# EAGLE design RC_Car_new (EAGLE 9.6.2)
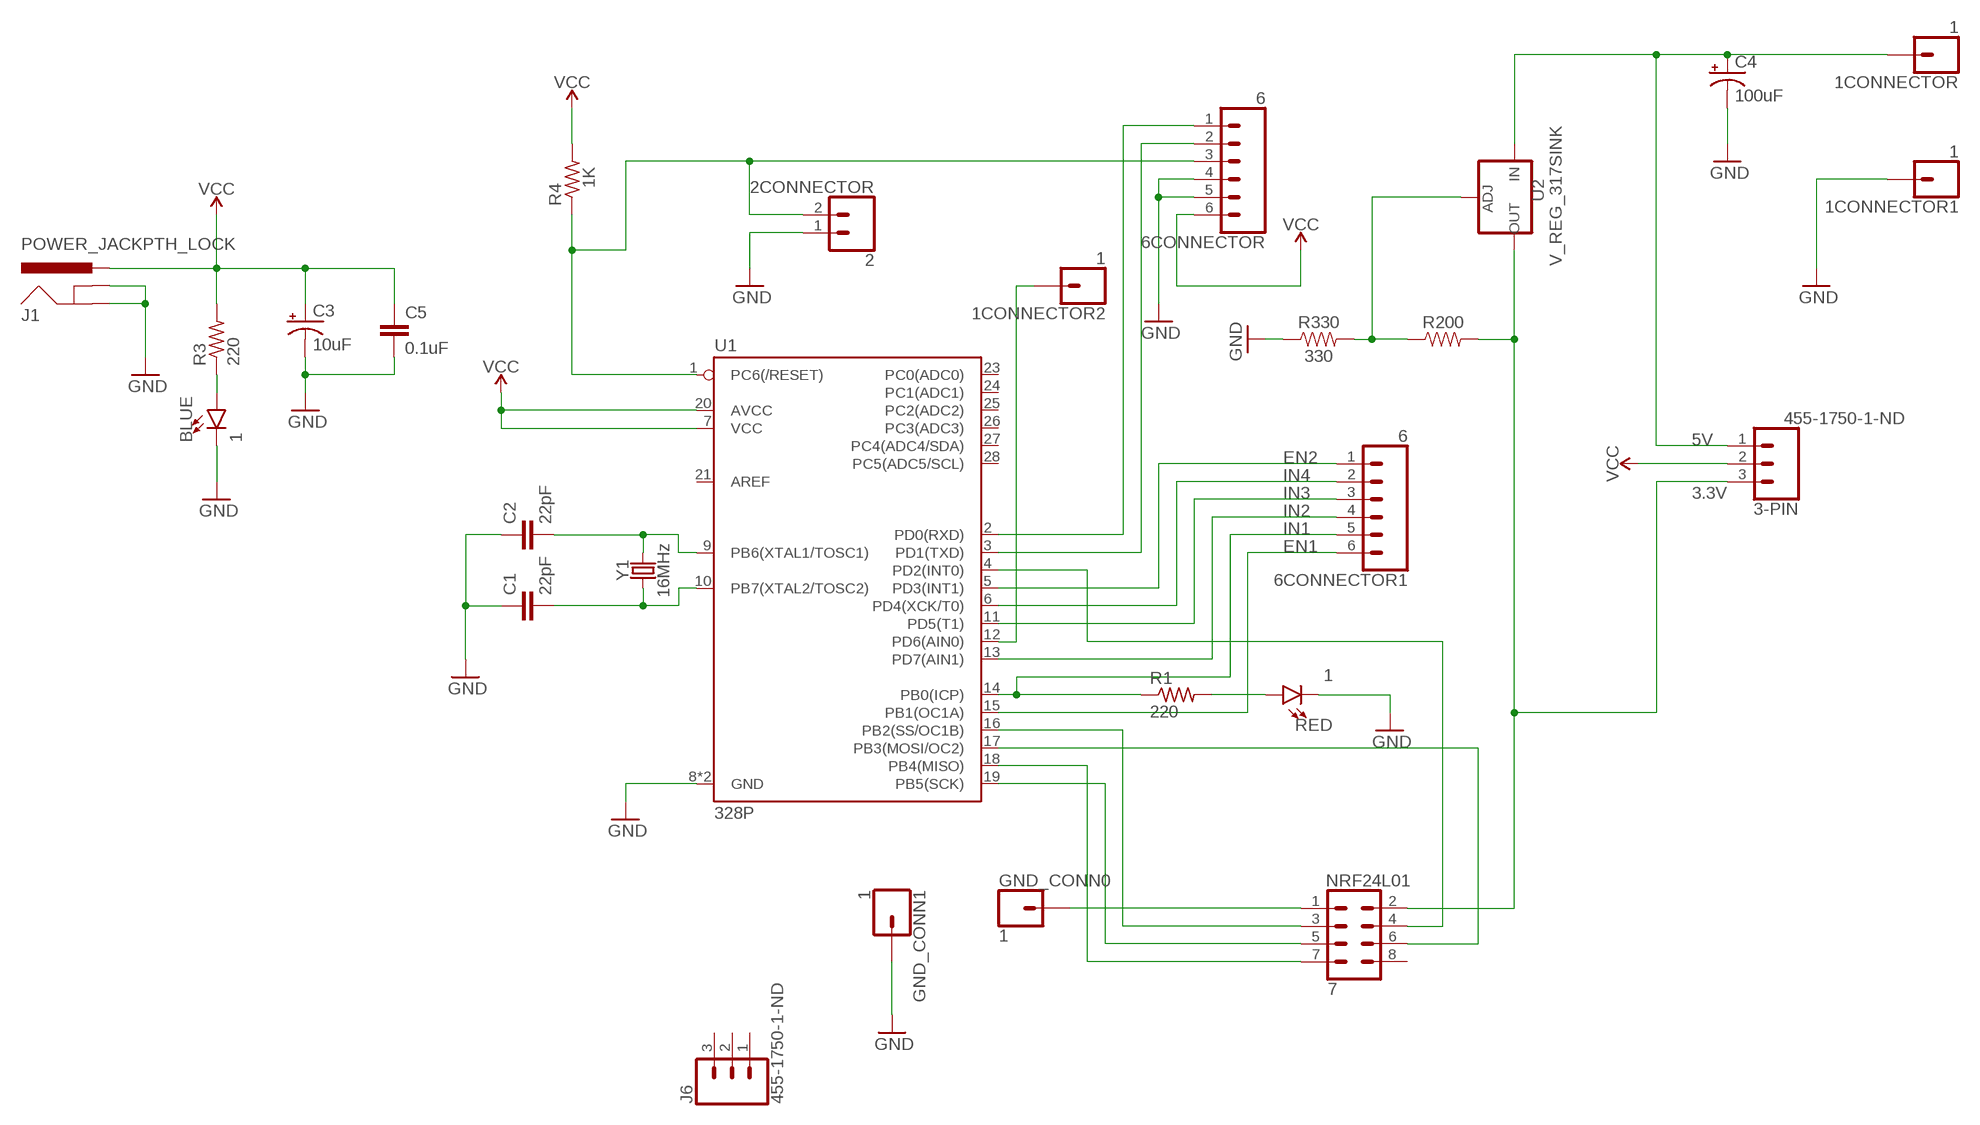
[diagram p0: schematic, sheet 1]

## Parts
1CONNECTOR  1  CONN_01  [1X01]
1CONNECTOR1  1  CONN_01  [1X01]
1CONNECTOR2  1  CONN_01  [1X01]
2CONNECTOR  2  CONN_02  [1X02]
3-PIN  455-1750-1-ND  CONN_03  [1X03]
6CONNECTOR  6  CONN_06SILK_FEMALE_PTH  [1X06]
6CONNECTOR1  6  CONN_06SILK_FEMALE_PTH  [1X06]
BLUE  1  LED3MM  [LED_3MM]
C1  22pF  22PF-PTH-2.54MM-200V-5%  [CAP-PTH-2.54]
C2  22pF  22PF-PTH-2.54MM-200V-5%  [CAP-PTH-2.54]
C3  10uF  10UF-POLAR-RADIAL-2.5MM-25V-20%  [CPOL-RADIAL-2.5MM-5MM]
C4  100uF  100UF-POLAR-RADIAL-2.5MM-25V-20%  [CPOL-RADIAL-2.5MM-6.5MM]
C5  0.1uF  0.1UF-KIT-EZ-50V-20%  [CAP-PTH-SMALL-KIT]
GND_CONN0  1  CONN_01  [1X01]
GND_CONN1  1  CONN_01  [1X01]
J1  POWER_JACKPTH_LOCK  [POWER_JACK_PTH_LOCK]
J6  455-1750-1-ND  CONN_03  [1X03]
NRF24L01  7  CONN_04X2  [2X4]
R1  220  R-US_0207/10  [0207/10]
R3  220  R-US_0207/10  [0207/10]
R4  1K  R-US_0207/10  [0207/10]
R200  RESISTORAXIAL-0.3  [AXIAL-0.3]
R330  330  330OHM-HORIZ-1/10W-5%  [AXIAL-0.3]
RED  1  LED3MM  [LED_3MM]
U1  328P  ATMEGA328P_PDIP  [DIP28]
U2  V_REG_317SINK  [TO220-ADJ]
Y1  16MHz  CRYSTAL-16MHZPTH-HC49US  [HC49US]

## Nets
3.3V: 3-PIN.3 NRF24L01.2 R200.P$2 U2.OUT
5V: 1CONNECTOR.1 3-PIN.1 C4.1(+) U2.IN
EN1: 6CONNECTOR1.6 U1.15(PB1(OC1A))
EN2: 6CONNECTOR1.1 U1.5(PD3(INT1))
GND: 1CONNECTOR1.1 2CONNECTOR.1 6CONNECTOR.4 6CONNECTOR.5 BLUE.K(C) C1.1 C2.1 C3.2(-) C4.2(-) C5.2 GND_CONN1.1 J1.GND J1.GNDBREAK R330.P$1 RED.K(C) U1.8(GND) U1.22(GND)
IN1: 6CONNECTOR1.5 R1.1 U1.14(PB0(ICP))
IN2: 6CONNECTOR1.4 U1.13(PD7(AIN1))
IN3: 6CONNECTOR1.3 U1.11(PD5(T1))
IN4: 6CONNECTOR1.2 U1.6(PD4(XCK/T0))
N$1: 2CONNECTOR.2 6CONNECTOR.3 R4.1 U1.1(PC6(/RESET))
N$2: BLUE.A R3.1
N$3: C2.2 U1.9(PB6(XTAL1/TOSC1)) Y1.2
N$4: C1.2 U1.10(PB7(XTAL2/TOSC2)) Y1.1
N$5: 1CONNECTOR2.1 U1.12(PD6(AIN0))
N$6: R1.2 RED.A
N$7: GND_CONN0.1 NRF24L01.1
N$8: NRF24L01.3 U1.16(PB2(SS/OC1B))
N$9: 6CONNECTOR.1 U1.2(PD0(RXD))
N$10: 6CONNECTOR.2 U1.3(PD1(TXD))
N$11: R200.P$1 R330.P$2 U2.ADJ
N$12: NRF24L01.4 U1.4(PD2(INT0))
N$13: NRF24L01.6 U1.17(PB3(MOSI/OC2))
N$14: NRF24L01.5 U1.19(PB5(SCK))
N$15: NRF24L01.7 U1.18(PB4(MISO))
VCC: 3-PIN.2 6CONNECTOR.6 C3.1(+) C5.1 J1.PWR R3.2 R4.2 U1.7(VCC) U1.20(AVCC)
Unconnected: J6.1 J6.2 J6.3 NRF24L01.8 U1.21(AREF) U1.23(PC0(ADC0)) U1.24(PC1(ADC1)) U1.25(PC2(ADC2)) U1.26(PC3(ADC3)) U1.27(PC4(ADC4/SDA)) U1.28(PC5(ADC5/SCL))

## Library data of the parts
1CONNECTOR 1CONNECTOR1 1CONNECTOR2 GND_CONN0 GND_CONN1 = SparkFun-Connectors:CONN_01: Single connection point. Often used as Generic Header-pin footprint for 0.1 inch spaced/style header connections On any of the 0.1 inch spaced packages, you can populate with these: Break Away Headers - Straight <https://www.sparkfun.com/products/116> (PRT-00116) Break Away Male Headers - Right Angle <https://www.sparkfun.com/products/553> (PRT-00553) Female Headers <https://www.sparkfun.com/products/115> (PRT-00115) Break Away Headers - Machine Pin <https://www.sparkfun.com/products/117> (PRT-00117) Break Away Female Headers - Swiss Machine Pin <https://www.sparkfun.com/products/743> (PRT-00743) This device is also useful as a general connection point to wire up your design to another part of your project. Our various solder wires solder well into these plated through hole pads. Hook-Up Wire - Assortment (Stranded, 22 AWG) <https://www.sparkfun.com/products/11375> (PRT-11375) Hook-Up Wire - Assortment (Solid Core, 22 AWG) <https://www.sparkfun.com/products/11367> (PRT-11367) View the entire wire category on our website here <https://www.sparkfun.com/categories/141> Special notes: SMTSO-256-ET is a "flush mount" nut for a 4-40 screw. We mostly use this on specialty testbeds; it is a nice way to connect hardware to your PCB at an adjustable hieght. Also note, the SNAP packages are for using a snappable style connector. We sell a baggie of snaps and they are also used on two LilyPad designs: Snap Assortment - 30 pack (male and female) <https://www.sparkfun.com/products/11347> (DEV-11347) LilyPad Arduino SimpleSnap <https://www.sparkfun.com/products/10941> (DEV-10941) LilyPad SimpleSnap Protoboard <https://www.sparkfun.com/products/10940> (DEV-10940)
2CONNECTOR = SparkFun-Connectors:CONN_02: Multi connection point. Often used as Generic Header-pin footprint for 0.1 inch spaced/style header connections On any of the 0.1 inch spaced packages, you can populate with these: Break Away Headers - Straight <https://www.sparkfun.com/products/116> (PRT-00116) Break Away Male Headers - Right Angle <https://www.sparkfun.com/products/553> (PRT-00553) Female Headers <https://www.sparkfun.com/products/115> (PRT-00115) Break Away Headers - Machine Pin <https://www.sparkfun.com/products/117> (PRT-00117) Break Away Female Headers - Swiss Machine Pin <https://www.sparkfun.com/products/743> (PRT-00743) For SCREWTERMINALS and SPRING TERMINALS visit here: Screw Terimnals on SparkFun.com <https://www.sparkfun.com/search/results?term=Screw+Terminals> (5mm/3.5mm/2.54mm spacing) This device is also useful as a general connection point to wire up your design to another part of your project. Our various solder wires solder well into these plated through hole pads. Hook-Up Wire - Assortment (Stranded, 22 AWG) <https://www.sparkfun.com/products/11375> (PRT-11375) Hook-Up Wire - Assortment (Solid Core, 22 AWG) <https://www.sparkfun.com/products/11367> (PRT-11367) View the entire wire category on our website here <https://www.sparkfun.com/categories/141> Special notes: Molex polarized connector foot print use with: PRT-08233 with associated crimp pins and housings. 2.54_SCREWTERM for use with PRT-10571. 3.5mm Screw Terminal footprints for PRT-08084 5mm Screw Terminal footprints for use with PRT-08432
3-PIN J6 = SparkFun-Connectors:CONN_03: Multi connection point. Often used as Generic Header-pin footprint for 0.1 inch spaced/style header connections On any of the 0.1 inch spaced packages, you can populate with these: Break Away Headers - Straight <https://www.sparkfun.com/products/116> (PRT-00116) Break Away Male Headers - Right Angle <https://www.sparkfun.com/products/553> (PRT-00553) Female Headers <https://www.sparkfun.com/products/115> (PRT-00115) Break Away Headers - Machine Pin <https://www.sparkfun.com/products/117> (PRT-00117) Break Away Female Headers - Swiss Machine Pin <https://www.sparkfun.com/products/743> (PRT-00743) Stackable Header - 3 Pin (Female, 0.1") <https://www.sparkfun.com/products/13875> (PRT-13875) For SCREWTERMINALS and SPRING TERMINALS visit here: Screw Terimnals on SparkFun.com <https://www.sparkfun.com/search/results?term=Screw+Terminals> (5mm/3.5mm/2.54mm spacing) This device is also useful as a general connection point to wire up your design to another part of your project. Our various solder wires solder well into these plated through hole pads. Hook-Up Wire - Assortment (Stranded, 22 AWG) <https://www.sparkfun.com/products/11375> (PRT-11375) Hook-Up Wire - Assortment (Solid Core, 22 AWG) <https://www.sparkfun.com/products/11367> (PRT-11367) View the entire wire category on our website here <https://www.sparkfun.com/categories/141> Special notes: Molex polarized connector foot print use with SKU : PRT-08232 with associated crimp pins and housings.; PROD_ID: XXX-00000
6CONNECTOR 6CONNECTOR1 = SparkFun-Connectors:CONN_06: Multi connection point. Often used as Generic Header-pin footprint for 0.1 inch spaced/style header connections On any of the 0.1 inch spaced packages, you can populate with these: Break Away Headers - Straight <https://www.sparkfun.com/products/116> (PRT-00116) Break Away Male Headers - Right Angle <https://www.sparkfun.com/products/553> (PRT-00553) Female Headers <https://www.sparkfun.com/products/115> (PRT-00115) Break Away Headers - Machine Pin <https://www.sparkfun.com/products/117> (PRT-00117) Break Away Female Headers - Swiss Machine Pin <https://www.sparkfun.com/products/743> (PRT-00743) Arduino Stackable Header - 6 Pin <https://www.sparkfun.com/products/9280> (PRT-09280) For SCREWTERMINALS and SPRING TERMINALS visit here: Screw Terimnals on SparkFun.com <https://www.sparkfun.com/search/results?term=Screw+Terminals> (5mm/3.5mm/2.54mm spacing) This device is also useful as a general connection point to wire up your design to another part of your project. Our various solder wires solder well into these plated through hole pads. Hook-Up Wire - Assortment (Stranded, 22 AWG) <https://www.sparkfun.com/products/11375> (PRT-11375) Hook-Up Wire - Assortment (Solid Core, 22 AWG) <https://www.sparkfun.com/products/11367> (PRT-11367) View the entire wire category on our website here <https://www.sparkfun.com/categories/141>; PROD_ID: CONN-08437
BLUE RED = SparkFun-LED:LED: LED (Generic) Standard schematic elements and footprints for 5mm, 3mm, 1206, and 0603 sized LEDs. Generic LEDs with no color specified.; PROD_ID: DIO-08794
C1 C2 = SparkFun-Capacitors:22PF: 22pF ceramic capacitors A capacitor is a passive two-terminal electrical component used to store electrical energy temporarily in an electric field.; PROD_ID: CAP-09128
C3 = SparkFun-Capacitors:10UF-POLAR: 10.0µF polarized capacitors A capacitor is a passive two-terminal electrical component used to store electrical energy temporarily in an electric field.; PROD_ID: CAP-08440
C4 = SparkFun-Capacitors:100UF-POLAR: 100µF polarized capacitors A capacitor is a passive two-terminal electrical component used to store electrical energy temporarily in an electric field.; PROD_ID: CAP-08439
C5 = SparkFun-Capacitors:0.1UF: 0.1µF ceramic capacitors A capacitor is a passive two-terminal electrical component used to store electrical energy temporarily in an electric field.; PROD_ID: CAP-08370
J1 = SparkFun-Connectors:POWER_JACK: Power Jack Connector This is the standard 5.5mm barrel jack for power. The PTH is the most common, proven, reliable, footprint. The Slot footprint only works if the mill layer is transmitted to the PCB fab house so be warned. Here are the connectors we sell at SparkFun: DC Barrel Power Jack/Connector <https://www.sparkfun.com/products/119> (PRT-00119) DC Barrel Power Jack/Connector (SMD) <https://www.sparkfun.com/products/12748> (PRT-12748) DC Barrel Jack Adapter - Breadboard Compatible <https://www.sparkfun.com/products/10811> (PRT-10811) It is used on this SparkFun product (and many, many others): SparkFun RedBoard - Programmed with Arduino <https://www.sparkfun.com/products/12757> (DEV-12757) Also, if you need a mating power supply or connector, please check these out: Wall Adapter Power Supply - 9VDC 650mA <https://www.sparkfun.com/products/298> (TOL-00298) DC Barrel Jack Adapter - Male <https://www.sparkfun.com/products/10287> (PRT-10287); PROD_ID: CONN-08197; SF_ID: PRT-00119
NRF24L01 = SparkFun-Connectors:CONN_04X2: Multi connection point. Often used as Generic Header-pin footprint for 0.1 inch spaced/style header connections On any of the 0.1 inch spaced packages, you can populate with these: Break Away Headers - Straight <https://www.sparkfun.com/products/116> (PRT-00116) Break Away Male Headers - Right Angle <https://www.sparkfun.com/products/553> (PRT-00553) Female Headers <https://www.sparkfun.com/products/115> (PRT-00115) Break Away Headers - Machine Pin <https://www.sparkfun.com/products/117> (PRT-00117) Break Away Female Headers - Swiss Machine Pin <https://www.sparkfun.com/products/743> (PRT-00743)
R1 R3 R4 = rcl:R-US_: RESISTOR, American symbol; SPICEPREFIX: R
R200 = SparkFun-Resistors:RESISTOR: Generic Resistor Package; PROD_ID: 200
R330 = SparkFun-Resistors:330OHM: 330Ω resistor A resistor is a passive two-terminal electrical component that implements electrical resistance as a circuit element. Resistors act to reduce current flow, and, at the same time, act to lower voltage levels within circuits. - Wikipedia; PROD_ID: RES-8371
U1 = SparkFun-IC-Microcontroller:ATMEGA328P_PDIP: Atmel 328P Through hole ATMEGA328P uC used in the Arduino 32kb flash, 1k EEPROM, 2k SRAM Datasheet <http://www.sparkfun.com/datasheets/Components/SMD/ATMega328.pdf> SparkFun Products Storefront component: AVR 28 Pin 20MHz 32K 6A/D - ATMega328P <https://www.sparkfun.com/products/9061> (COM-09061) SparkFun Simon Says - Through-Hole Soldering Kit <https://www.sparkfun.com/products/10547> (KIT-10547) SparkFun Learn to Solder - Simon Says <https://www.sparkfun.com/products/13708> (KIT-13708) SparkFun BigTime Watch Kit <https://www.sparkfun.com/products/11734> (KIT-11734) SparkFun ClockIt <https://www.sparkfun.com/products/10930> (KIT-10930) SparkFun Serial Enabled LCD Kit <https://www.sparkfun.com/products/10097> (LCD-10097) SparkFun Simon Tilts - Through Hole Soldering Kit <https://www.sparkfun.com/products/12634> (KIT-12634) SparkFun Frequency Counter Kit <https://www.sparkfun.com/products/10140> (KIT-10140) FabFM Radio Kit <https://www.sparkfun.com/products/11043> (KIT-11043) SparkFun Binary Blaster Kit <https://www.sparkfun.com/products/12037> (KIT-12037) SparkFun Metro-Gnome <https://www.sparkfun.com/products/9236> (KIT-09236) ATmega328 with Arduino Optiboot (Uno) <https://www.sparkfun.com/products/10524> (DEV-10524); PROD_ID: IC-09136
U2 = SparkFun-IC-Power:V_REG_317: Voltage Regulator Standard LM317 adjustable voltage regulator. AOI (Adjust Output Input). Google 'LM317 Calculator' for easy to use app to get the two resistor values needed. 240/720 for 5V output. 240/390 for 3.3V output. Spark Fun Electronics SKU : COM-00527
Y1 = SparkFun-Clocks:CRYSTAL-16MHZ: 16MHz Crystal Digikey Example <http://www.digikey.com/product-search/en?keywords=535-9122-1-ND> Frequency: 16MHz Frequency Stability: ±50ppm Frequency Tolerance: ±20ppm Load Capacitance: 18pF SparkFun Products: Pro Micro -5V/16MHz <https://www.sparkfun.com/products/12640> SparkFun Serial Enabled LCD Kit <https://www.sparkfun.com/products/10097>; PROD_ID: XTAL-08181; SF_ID: COM-00536

## Net classes
0 default: width 0.254 mm, drill 0.508 mm, clearance 0.254 mm

## Board
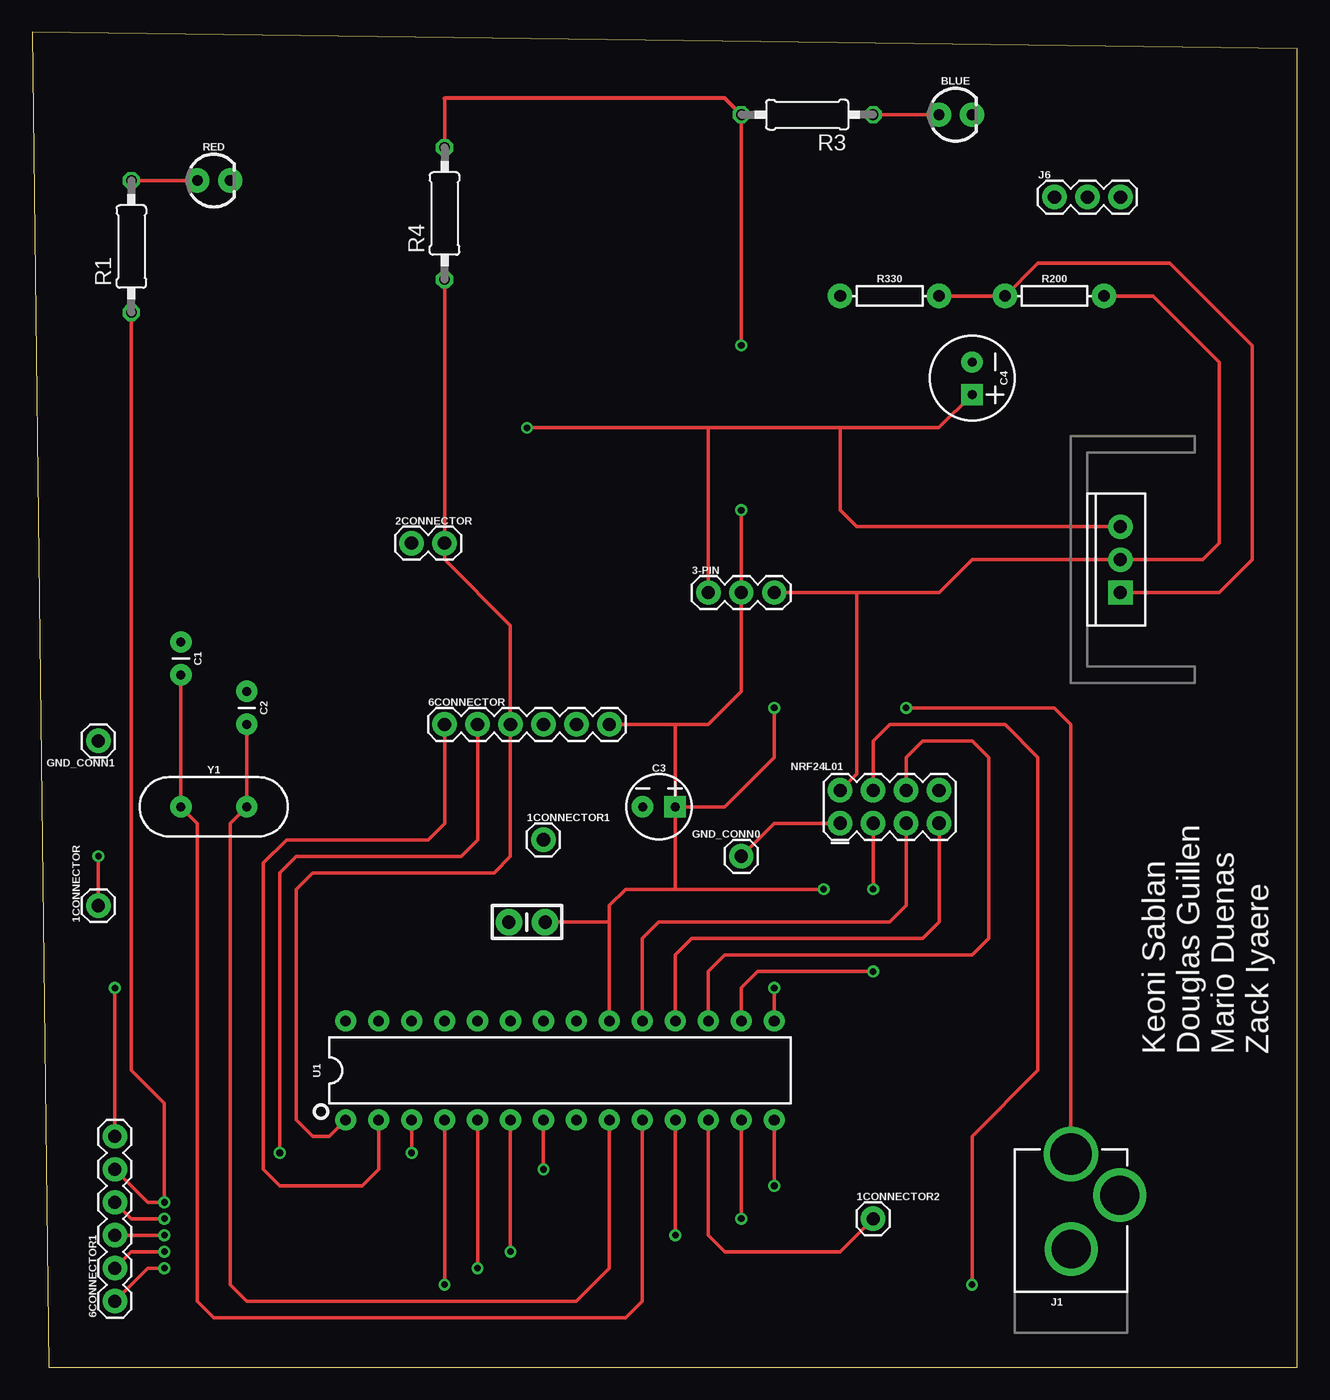
[diagram p1: board, top side]
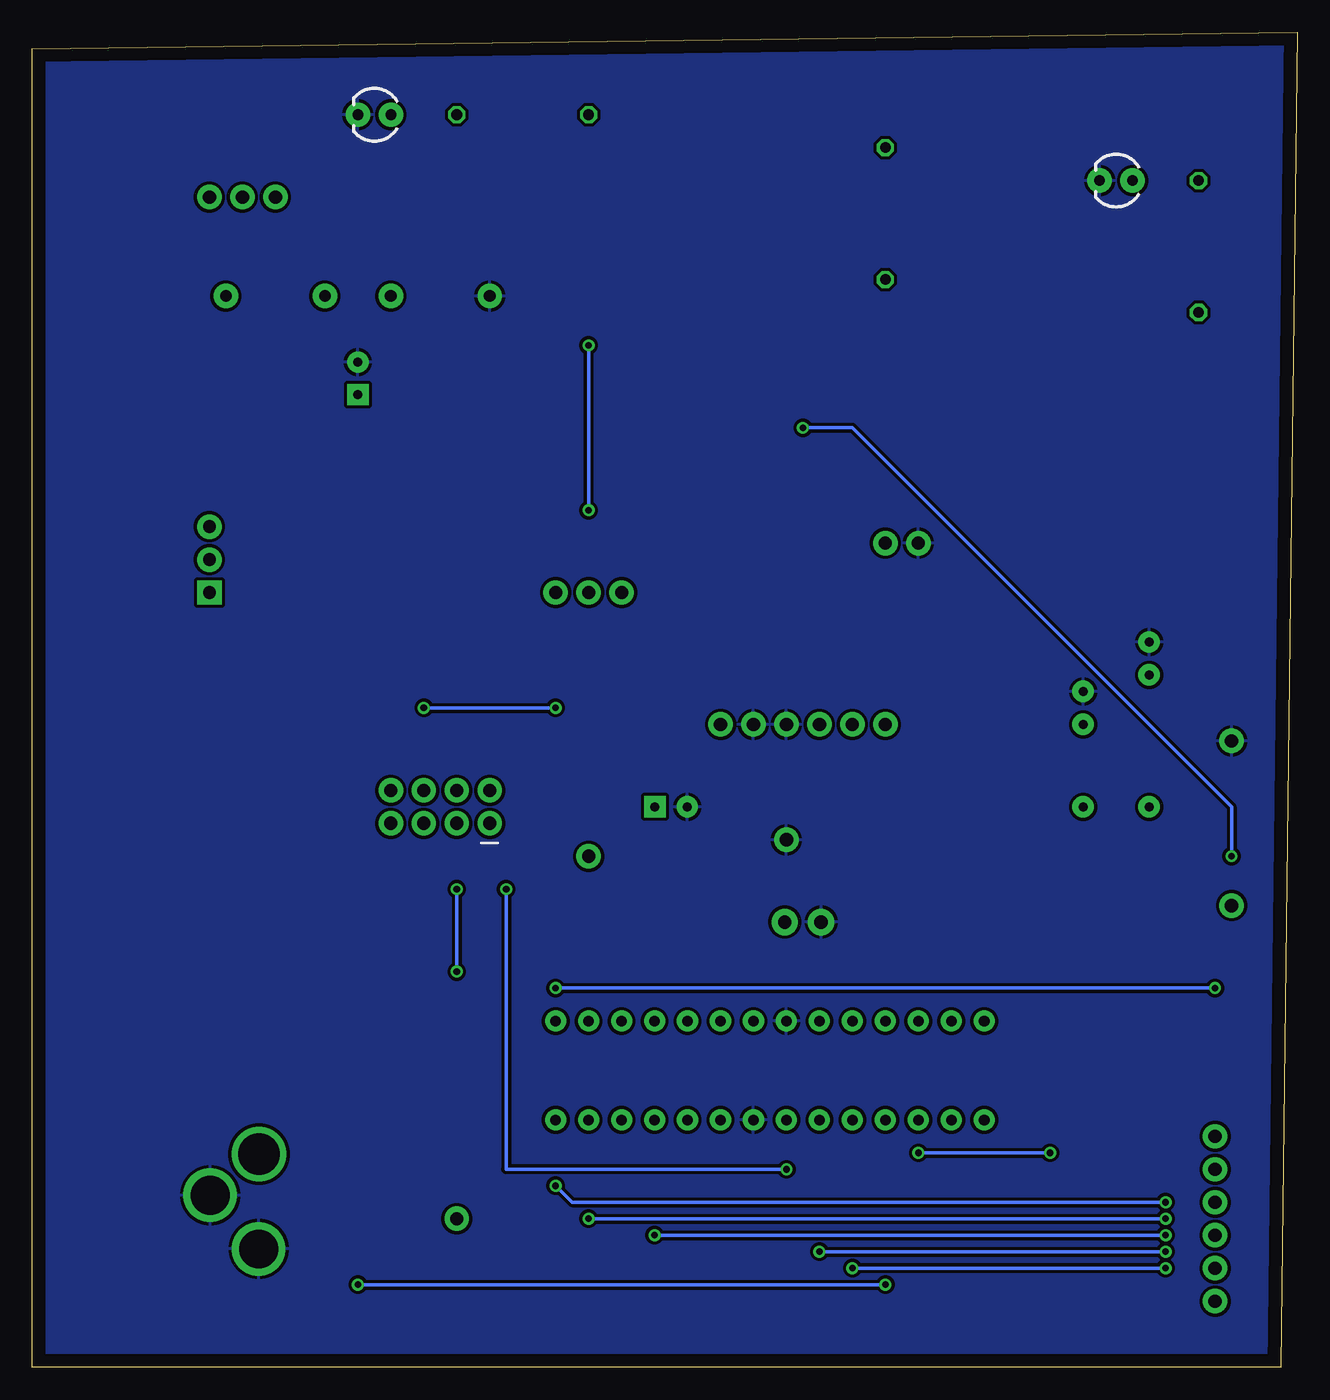
[diagram p2: board, bottom side, seen from below]

Size 97.46 x 102.86 mm. Coordinates in mm from the lower left corner, seen from the top.
Outline: 1.27,0 97.46,0 97.46,101.59 0,102.86 1.27,0
Copper layers (1*16): Top 0.035mm / dielectric 1.5mm / Bottom 0.035mm
Design rules "default": minimum track width 6mil, minimum drill 0.35mm, track to track 6mil, track to pad 6mil, pad to pad 6mil, via to via 6mil, smd to smd 6mil, copper to edge 40mil, drill to drill 6mil, minimum pad ring 10mil, minimum via ring 8mil, stop-mask expansion 4mil, vias tented up to drill 0mil, thermal gap 10mil

### Footprints (pad centres in the part's own frame; a part is rotated, then mirrored left to right if it is on the bottom)
1X01 = drill 1.016 pad 1.88: 1 0,0
1X02 = drill 1.016 pad 1.88: 1 0,0; 2 2.54,0
1X03 = drill 1.016 pad 1.88: 1 0,0; 2 2.54,0; 3 5.08,0
1X06 = drill 1.016 pad 1.88: 1 0,0; 2 2.54,0; 3 5.08,0; 4 7.62,0; 5 10.16,0; 6 12.7,0
LED_3MM = drill 0.813 pad 1.88: A -1.27,0; K 1.27,0
CAP-PTH-2.54 = drill 0.7 pad 1.651: 1 -1.27,0; 2 1.27,0
CPOL-RADIAL-2.5MM-5MM = drill 0.7 pad 1.651 square: 1 1.25,0 | drill 0.7 pad 1.651: 2 -1.25,0
CPOL-RADIAL-2.5MM-6.5MM = drill 0.7 pad 1.651 square: 1 1.25,0 | drill 0.7 pad 1.651: 2 -1.25,0
CAP-PTH-SMALL-KIT = drill 1.016 pad 2.032: 1 -1.397,0; 2 1.397,0
POWER_JACK_PTH_LOCK = drill 2.997 pad 4.115: GND 0.025,6.557; GNDBREAK 3.762,10.7 | drill 3.2 pad 4.115: PWR 0,13.878
2X4 = drill 1.016 pad 1.88: 1 -3.81,-1.27; 2 -3.81,1.27; 3 -1.27,-1.27; 4 -1.27,1.27; 5 1.27,-1.27; 6 1.27,1.27; 7 3.81,-1.27; 8 3.81,1.27
0207/10 = drill 0.813 octagon: 1 -5.08,0; 2 5.08,0
AXIAL-0.3 = drill 0.9 pad 1.88: P$1 -3.81,0; P$2 3.81,0
DIP28 = drill 0.813 pad 1.626: 1 -16.51,-3.81; 2 -13.97,-3.81; 3 -11.43,-3.81; 4 -8.89,-3.81; 5 -6.35,-3.81; 6 -3.81,-3.81; 7 -1.27,-3.81; 8 1.27,-3.81; 9 3.81,-3.81; 10 6.35,-3.81; 11 8.89,-3.81; 12 11.43,-3.81; 13 13.97,-3.81; 14 16.51,-3.81; 15 16.51,3.81; 16 13.97,3.81; 17 11.43,3.81; 18 8.89,3.81; 19 6.35,3.81; 20 3.81,3.81; 21 1.27,3.81; 22 -1.27,3.81; 23 -3.81,3.81; 24 -6.35,3.81; 25 -8.89,3.81; 26 -11.43,3.81; 27 -13.97,3.81; 28 -16.51,3.81
TO220-ADJ = drill 1 pad 1.88 square: ADJ -2.54,0 | drill 1 pad 1.88: IN 2.54,0; OUT 0,0
HC49US = drill 0.7 pad 1.651: 1 -2.54,0; 2 2.54,0

### Placement (x,y rotation side)
1CONNECTOR  5.08,35.56 90 top
1CONNECTOR1  39.37,40.64 0 top
1CONNECTOR2  64.77,11.43 0 top
2CONNECTOR  29.21,63.5 0 top
3-PIN  52.07,59.69 0 top
6CONNECTOR  31.75,49.53 0 top
6CONNECTOR1  6.35,5.08 90 top
BLUE  71.12,96.52 0 top
C1  11.43,54.61 270 top
C2  16.51,50.8 270 top
C3  48.26,43.18 0 top
C4  72.39,76.2 270 top
C5  38.1,34.29 180 top
GND_CONN0  54.61,39.37 0 top
GND_CONN1  5.08,48.26 180 top
J1  80.01,2.54 0 top
J6  78.74,90.17 0 top
NRF24L01  66.04,43.18 0 top
R1  7.62,86.36 90 top
R3  59.69,96.52 180 top
R4  31.75,88.9 90 top
R200  78.74,82.55 0 top
R330  66.04,82.55 0 top
RED  13.97,91.44 0 top
U1  40.64,22.86 0 top
U2  83.82,62.23 90 top
Y1  13.97,43.18 0 top

### Tracks (layer width: path | path; a pad name or v marks a point on that pad's centre or on a via)
3.3V
  Top 0.254: 3-PIN.3 63.5,59.69 | 63.5,59.69 63.5,45.72 NRF24L01.2 | 63.5,59.69 69.85,59.69 72.39,62.23 U2.OUT 90.17,62.23 91.44,63.5 91.44,77.47 86.36,82.55 R200.P$2
5V  (via drill 0.51)
  Top 0.254: 52.07,72.39 3-PIN.1 | v38.1,72.39 52.07,72.39 | C4.1 69.83,72.39 62.23,72.39 | 62.23,72.39 52.07,72.39 | U2.IN 63.5,64.77 62.23,66.04 62.23,72.39 | v5.08,39.37 1CONNECTOR.1
  Bottom 0.254: v38.1,72.39 34.29,72.39 5.08,43.18 v5.08,39.37
EN1  (via drill 0.51)
  Top 0.254: v57.15,29.21 U1.15 | v6.35,29.21 6CONNECTOR1.6
  Bottom 0.254: v57.15,29.21 v6.35,29.21
EN2  (via drill 0.51)
  Top 0.254: v34.29,7.62 U1.5 | v10.16,7.62 8.89,7.62 6CONNECTOR1.1
  Bottom 0.254: v10.16,7.62 v34.29,7.62
GND
  pour Bottom: -1.27,104.32 -1.27,-1.02 99.05,-1.63 99,103.76
IN1  (via drill 0.51)
  Top 0.254: U1.14 v57.15,13.97 | 6CONNECTOR1.5 8.89,12.7 v10.16,12.7 10.16,20.32 7.62,22.86 R1.1
  Bottom 0.254: v10.16,12.7 55.88,12.7 v57.15,13.97
IN2  (via drill 0.51)
  Top 0.254: U1.13 v54.61,11.43 | v10.16,11.43 7.62,11.43 6CONNECTOR1.4
  Bottom 0.254: v54.61,11.43 v10.16,11.43
IN3  (via drill 0.51)
  Top 0.254: U1.11 v49.53,10.16 | v10.16,10.16 6CONNECTOR1.3
  Bottom 0.254: v49.53,10.16 v10.16,10.16
IN4  (via drill 0.51)
  Top 0.254: U1.6 v36.83,8.89 | v10.16,8.89 7.62,8.89 6CONNECTOR1.2
  Bottom 0.254: v36.83,8.89 v10.16,8.89
N$1
  Top 0.254: R4.1 2CONNECTOR.2 31.75,62.23 36.83,57.15 6CONNECTOR.3 36.83,39.37 35.56,38.1 21.59,38.1 20.32,36.83 20.32,19.05 21.59,17.78 22.86,17.78 U1.1
N$2
  Top 0.254: R3.1 BLUE.A
N$3
  Top 0.254: C2.2 Y1.2 15.24,41.91 15.24,6.35 16.51,5.08 41.91,5.08 44.45,7.62 U1.9
N$4
  Top 0.254: C1.2 Y1.1 12.7,41.91 12.7,5.08 13.97,3.81 45.72,3.81 46.99,5.08 U1.10
N$5
  Top 0.254: 1CONNECTOR2.1 62.23,8.89 53.34,8.89 52.07,10.16 U1.12
N$6
  Top 0.254: RED.A R1.2
N$7
  Top 0.254: NRF24L01.1 57.15,41.91 GND_CONN0.1
N$8  (via drill 0.51)
  Top 0.254: NRF24L01.3 v64.77,36.83 | v64.77,30.48 55.88,30.48 54.61,29.21 U1.16
  Bottom 0.254: v64.77,36.83 v64.77,30.48
N$9
  Top 0.254: U1.2 26.67,15.24 25.4,13.97 19.05,13.97 17.78,15.24 17.78,38.84 19.58,40.64 30.48,40.64 31.75,41.91 6CONNECTOR.1
N$10  (via drill 0.51)
  Top 0.254: v29.21,16.51 U1.3 | v19.05,16.51 19.05,38.1 20.32,39.37 33.02,39.37 34.29,40.64 6CONNECTOR.2
  Bottom 0.254: v29.21,16.51 v19.05,16.51
N$11
  Top 0.254: U2.ADJ 91.44,59.69 93.98,62.23 93.98,78.74 87.63,85.09 77.47,85.09 R200.P$1 R330.P$2
N$12  (via drill 0.51)
  Top 0.254: v72.39,6.35 72.39,17.78 77.47,22.86 77.47,46.99 74.93,49.53 66.04,49.53 64.77,48.26 NRF24L01.4 | U1.4 v31.75,6.35
  Bottom 0.254: v72.39,6.35 v31.75,6.35
N$13
  Top 0.254: NRF24L01.6 67.31,46.99 68.58,48.26 72.39,48.26 73.66,46.99 73.66,33.02 72.39,31.75 53.34,31.75 52.07,30.48 U1.17
N$14
  Top 0.254: NRF24L01.5 67.31,35.56 66.04,34.29 48.26,34.29 46.99,33.02 U1.19
N$15
  Top 0.254: NRF24L01.7 69.85,34.29 68.58,33.02 50.8,33.02 49.53,31.75 U1.18
VCC  (via drill 0.51)
  Top 0.254: 49.53,49.53 52.07,49.53 54.61,52.07 3-PIN.2 v54.61,66.04 | v54.61,78.74 R3.2 | v57.15,50.8 57.15,46.99 53.34,43.18 C3.1 | U1.20 44.45,34.29 | 44.45,34.29 44.45,35.56 45.72,36.83 49.53,36.83 | U1.7 v39.37,15.24 | v60.96,36.83 49.53,36.83 | R4.2 31.75,97.79 | v67.31,50.8 78.74,50.8 80.01,49.53 J1.PWR | 49.53,49.53 49.51,49.51 C3.1 | C3.1 49.53,43.16 49.53,36.83 | C5.1 44.45,34.29 | 6CONNECTOR.6 49.53,49.53
  Top 0.305: 31.75,97.79 53.34,97.79 R3.2
  Bottom 0.254: v54.61,66.04 v54.61,78.74 | v67.31,50.8 v57.15,50.8 | v39.37,15.24 60.96,15.24 v60.96,36.83

### Text on the board
tPlace: Keoni Sablan / Douglas Guillen / Mario Duenas / Zack Iyaere